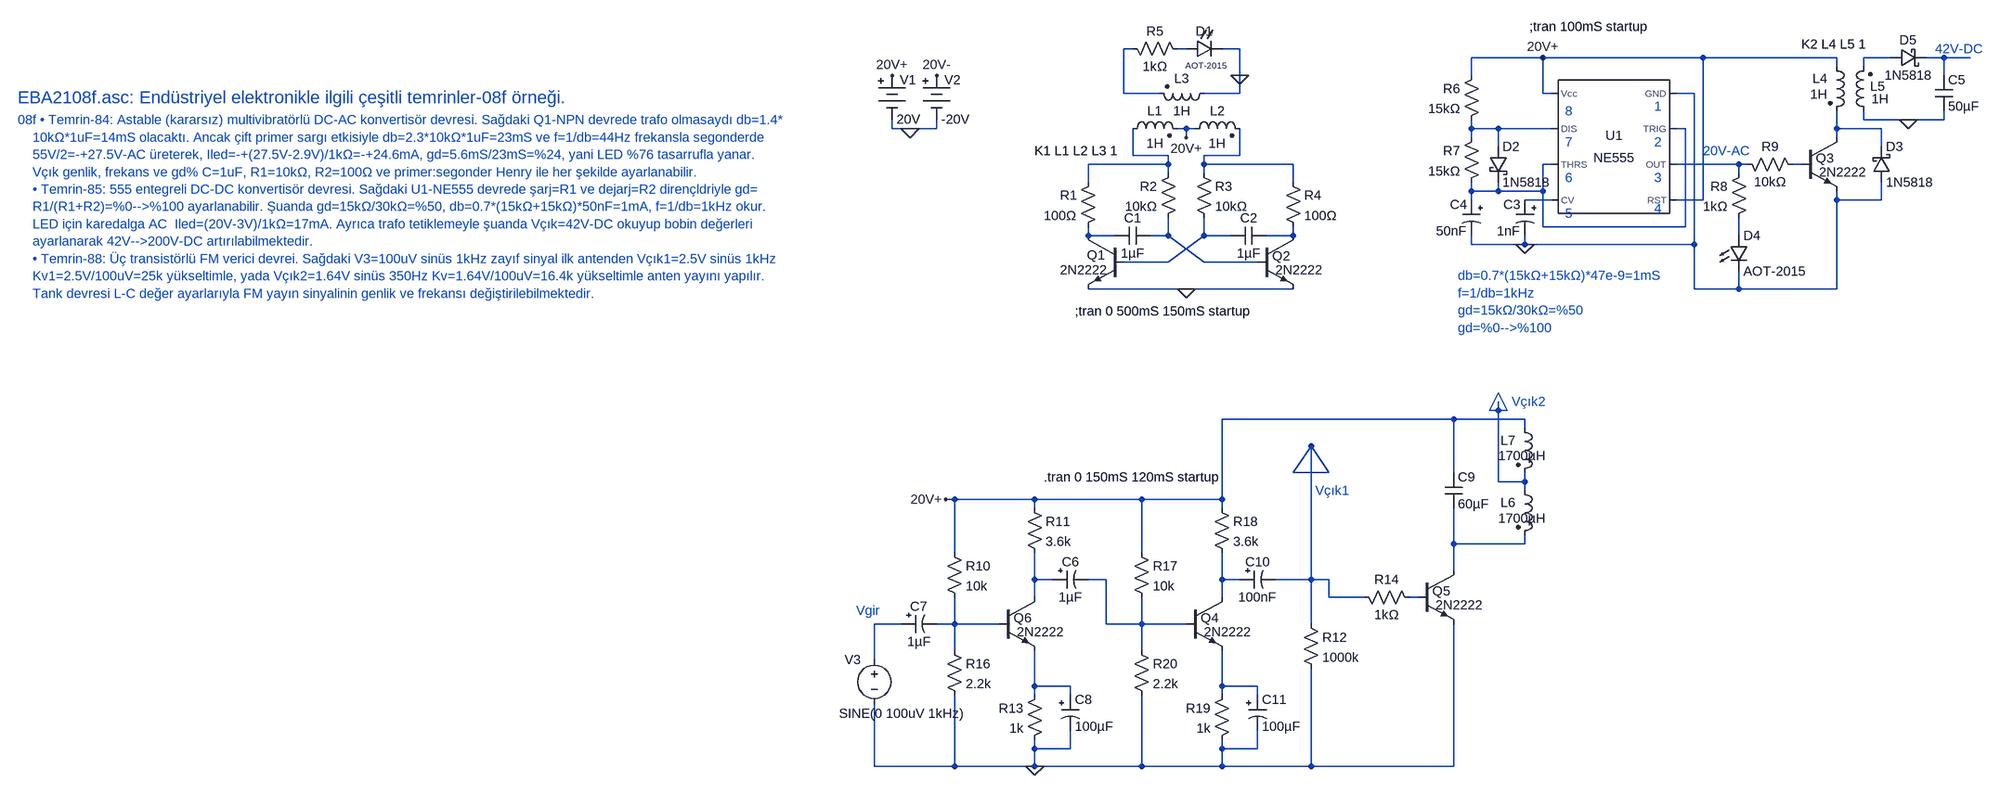
[diagram p0: schematic EBA2108f.asc]
EBA2108f.asc, the LTspice schematic file:
Version 4
SHEET 1 7064 4332
WIRE 2096 -32 2080 -32
WIRE 2192 -32 2176 -32
WIRE 2288 -32 2256 -32
WIRE 2832 -16 2704 -16
WIRE 3120 -16 2832 -16
WIRE 3360 -16 3120 -16
WIRE 3456 -16 3408 -16
WIRE 3552 -16 3520 -16
WIRE 3600 -16 3552 -16
WIRE 3360 0 3360 -16
WIRE 3408 0 3408 -16
WIRE 2288 16 2288 -32
WIRE 2704 16 2704 -16
WIRE 3552 16 3552 -16
WIRE 2080 48 2080 -32
WIRE 2144 48 2080 48
WIRE 2288 48 2288 16
WIRE 2288 48 2224 48
WIRE 2832 48 2832 -16
WIRE 2848 48 2832 48
WIRE 3104 48 3072 48
WIRE 3408 96 3408 80
WIRE 3488 96 3408 96
WIRE 3552 96 3552 80
WIRE 3552 96 3488 96
WIRE 1664 112 1664 96
WIRE 1696 112 1664 112
WIRE 1744 112 1744 96
WIRE 1744 112 1696 112
WIRE 2192 112 2176 112
WIRE 2208 112 2192 112
WIRE 2704 112 2704 96
WIRE 2752 112 2704 112
WIRE 2848 112 2752 112
WIRE 3088 112 3072 112
WIRE 3360 112 3360 80
WIRE 3440 112 3360 112
WIRE 2192 128 2192 112
WIRE 2704 128 2704 112
WIRE 3360 128 3360 112
WIRE 2752 144 2752 112
WIRE 3440 144 3440 112
WIRE 2096 160 2096 112
WIRE 2160 160 2096 160
WIRE 2288 160 2288 112
WIRE 2288 160 2224 160
WIRE 2160 176 2160 160
WIRE 2160 176 2016 176
WIRE 2224 176 2224 160
WIRE 2384 176 2224 176
WIRE 2848 176 2832 176
WIRE 3184 176 3072 176
WIRE 3200 176 3184 176
WIRE 3296 176 3280 176
WIRE 2160 192 2160 176
WIRE 2224 192 2224 176
WIRE 3184 192 3184 176
WIRE 2016 208 2016 176
WIRE 2384 208 2384 176
WIRE 2704 224 2704 208
WIRE 2752 224 2752 208
WIRE 2752 224 2704 224
WIRE 2832 224 2832 176
WIRE 2832 224 2752 224
WIRE 2704 240 2704 224
WIRE 2848 240 2800 240
WIRE 3120 240 3120 -16
WIRE 3120 240 3072 240
WIRE 3360 240 3360 224
WIRE 3440 240 3440 208
WIRE 3440 240 3360 240
WIRE 2832 288 2832 224
WIRE 3088 288 3088 112
WIRE 3088 288 2832 288
WIRE 2016 304 2016 288
WIRE 2064 304 2016 304
WIRE 2160 304 2160 272
WIRE 2160 304 2128 304
WIRE 2224 304 2224 272
WIRE 2272 304 2224 304
WIRE 2384 304 2384 288
WIRE 2384 304 2336 304
WIRE 3184 304 3184 272
WIRE 2704 320 2704 304
WIRE 2800 320 2800 304
WIRE 2800 320 2704 320
WIRE 3104 320 3104 48
WIRE 3104 320 2800 320
WIRE 2160 352 2224 304
WIRE 2160 352 2080 352
WIRE 2224 352 2160 304
WIRE 2320 352 2224 352
WIRE 2192 400 2016 400
WIRE 2384 400 2192 400
WIRE 3104 400 3104 320
WIRE 3184 400 3184 368
WIRE 3184 400 3104 400
WIRE 3360 400 3360 240
WIRE 3360 400 3184 400
WIRE 2736 640 2752 608
WIRE 2752 640 2752 624
WIRE 2752 640 2736 640
WIRE 2768 640 2752 608
WIRE 2768 640 2752 640
WIRE 2672 656 2256 656
WIRE 2800 656 2672 656
WIRE 2800 672 2800 656
WIRE 2384 752 2416 704
WIRE 2448 752 2416 704
WIRE 2448 752 2384 752
WIRE 2672 752 2672 656
WIRE 2752 768 2752 640
WIRE 2800 768 2800 752
WIRE 2800 768 2752 768
WIRE 2800 784 2800 768
WIRE 1776 800 1760 800
WIRE 1920 800 1776 800
WIRE 2112 800 1920 800
WIRE 2256 800 2256 656
WIRE 2256 800 2112 800
WIRE 1920 816 1920 800
WIRE 2256 816 2256 800
WIRE 2672 880 2672 816
WIRE 2800 880 2800 864
WIRE 2800 880 2672 880
WIRE 1776 896 1776 800
WIRE 2112 896 2112 800
WIRE 2672 928 2672 880
WIRE 1920 944 1920 896
WIRE 1952 944 1920 944
WIRE 2048 944 2016 944
WIRE 2256 944 2256 896
WIRE 2288 944 2256 944
WIRE 2416 944 2416 704
WIRE 2416 944 2352 944
WIRE 2448 944 2416 944
WIRE 1920 976 1920 944
WIRE 2256 976 2256 944
WIRE 2448 976 2448 944
WIRE 2512 976 2448 976
WIRE 2608 976 2592 976
WIRE 1680 1024 1632 1024
WIRE 1776 1024 1776 976
WIRE 1776 1024 1744 1024
WIRE 1856 1024 1776 1024
WIRE 2048 1024 2048 944
WIRE 2112 1024 2112 976
WIRE 2112 1024 2048 1024
WIRE 2192 1024 2112 1024
WIRE 2416 1024 2416 944
WIRE 1776 1072 1776 1024
WIRE 2112 1072 2112 1024
WIRE 1632 1088 1632 1024
WIRE 1920 1136 1920 1072
WIRE 1984 1136 1920 1136
WIRE 2256 1136 2256 1072
WIRE 2320 1136 2256 1136
WIRE 1920 1152 1920 1136
WIRE 1984 1152 1984 1136
WIRE 2256 1152 2256 1136
WIRE 2320 1152 2320 1136
WIRE 1920 1248 1920 1232
WIRE 1984 1248 1984 1216
WIRE 1984 1248 1920 1248
WIRE 2256 1248 2256 1232
WIRE 2320 1248 2320 1216
WIRE 2320 1248 2256 1248
WIRE 1632 1280 1632 1168
WIRE 1776 1280 1776 1152
WIRE 1776 1280 1632 1280
WIRE 1920 1280 1920 1248
WIRE 1920 1280 1776 1280
WIRE 2112 1280 2112 1152
WIRE 2112 1280 1920 1280
WIRE 2256 1280 2256 1248
WIRE 2256 1280 2112 1280
WIRE 2416 1280 2416 1104
WIRE 2416 1280 2256 1280
WIRE 2672 1280 2672 1024
WIRE 2672 1280 2416 1280
FLAG 1696 112 0
FLAG 1664 16 20V+
FLAG 1744 16 20V-
FLAG 2192 400 0
FLAG 2192 128 20V+
FLAG 2288 16 0
FLAG 2800 320 0
FLAG 2832 -16 20V+
FLAG 3488 96 0
FLAG 1760 800 20V+
FLAG 1920 1280 0
SYMBOL Misc\\battery 1664 0 R0
WINDOW 3 8 95 Left 2
WINDOW 0 14 24 Left 2
SYMATTR Value 20V
SYMATTR InstName V1
SYMBOL Misc\\battery 1744 0 R0
WINDOW 3 8 95 Left 2
WINDOW 0 14 24 Left 2
SYMATTR Value -20V
SYMATTR InstName V2
SYMBOL npn 2080 304 M0
WINDOW 0 34 35 Left 2
WINDOW 3 30 62 Left 2
SYMATTR InstName Q1
SYMATTR Value 2N2222
SYMBOL res 2032 192 M0
SYMATTR InstName R1
SYMATTR Value 100Ω
SYMBOL cap 2128 288 R90
WINDOW 0 0 32 VBottom 2
WINDOW 3 32 32 VTop 2
SYMATTR InstName C1
SYMATTR Value 1µF
SYMBOL res 2176 176 M0
SYMATTR InstName R2
SYMATTR Value 10kΩ
SYMBOL npn 2320 304 R0
WINDOW 0 26 37 Left 2
WINDOW 3 32 62 Left 2
SYMATTR InstName Q2
SYMATTR Value 2N2222
SYMBOL cap 2272 288 M90
WINDOW 0 0 32 VBottom 2
WINDOW 3 32 32 VTop 2
SYMATTR InstName C2
SYMATTR Value 1µF
SYMBOL res 2208 176 R0
SYMATTR InstName R3
SYMATTR Value 10kΩ
SYMBOL res 2368 192 R0
SYMATTR InstName R4
SYMATTR Value 100Ω
SYMBOL ind2 2080 128 R270
WINDOW 0 32 56 VTop 2
WINDOW 3 5 56 VBottom 2
SYMATTR InstName L1
SYMATTR Value 1H
SYMATTR Type ind
SYMBOL ind2 2192 128 R270
WINDOW 0 32 56 VTop 2
WINDOW 3 5 56 VBottom 2
SYMATTR InstName L2
SYMATTR Value 1H
SYMATTR Type ind
SYMBOL ind2 2240 32 R90
WINDOW 0 5 56 VBottom 2
WINDOW 3 32 56 VTop 2
SYMATTR InstName L3
SYMATTR Value 1H
SYMATTR Type ind
SYMBOL LED 2192 -48 M90
WINDOW 0 0 32 VBottom 2
WINDOW 3 36 36 VTop 1
SYMATTR InstName D1
SYMATTR Value AOT-2015
SYMATTR Description Diode
SYMATTR Type diode
SYMBOL res 2080 -48 M90
WINDOW 0 0 56 VBottom 2
WINDOW 3 32 56 VTop 2
SYMATTR InstName R5
SYMATTR Value 1kΩ
SYMBOL Misc\\NE555 2960 144 M0
SYMATTR InstName U1
SYMBOL polcap 2816 240 M0
SYMATTR InstName C3
SYMATTR Value 1nF
SYMBOL polcap 2720 240 M0
SYMATTR InstName C4
SYMATTR Value 50nF
SYMBOL res 2720 0 M0
SYMATTR InstName R6
SYMATTR Value 15kΩ
SYMBOL res 2720 112 M0
SYMATTR InstName R7
SYMATTR Value 15kΩ
SYMBOL schottky 2736 144 R0
SYMATTR InstName D2
SYMATTR Value 1N5818
SYMATTR Description Diode
SYMATTR Type diode
SYMBOL res 3200 176 M0
SYMATTR InstName R8
SYMATTR Value 1kΩ
SYMBOL npn 3296 128 R0
WINDOW 0 26 37 Left 2
WINDOW 3 32 62 Left 2
SYMATTR InstName Q3
SYMATTR Value 2N2222
SYMBOL schottky 3424 208 M180
WINDOW 0 24 64 Left 2
WINDOW 3 24 0 Left 2
SYMATTR InstName D3
SYMATTR Value 1N5818
SYMATTR Description Diode
SYMATTR Type diode
SYMBOL ind2 3344 -16 R0
WINDOW 0 -28 38 Left 2
WINDOW 3 -32 66 Left 2
SYMATTR InstName L4
SYMATTR Value 1H
SYMATTR Type ind
SYMBOL ind2 3424 96 R180
WINDOW 0 -23 60 Left 2
WINDOW 3 -29 38 Left 2
SYMATTR InstName L5
SYMATTR Value 1H
SYMATTR Type ind
SYMBOL LED 3168 304 R0
SYMATTR InstName D4
SYMATTR Value AOT-2015
SYMATTR Description Diode
SYMATTR Type diode
SYMBOL schottky 3456 -32 M90
WINDOW 0 0 32 VBottom 2
WINDOW 3 32 32 VTop 2
SYMATTR InstName D5
SYMATTR Value 1N5818
SYMATTR Description Diode
SYMATTR Type diode
SYMBOL cap 3536 16 R0
SYMATTR InstName C5
SYMATTR Value 50µF
SYMBOL res 3296 192 M270
WINDOW 0 32 56 VTop 2
WINDOW 3 0 56 VBottom 2
SYMATTR InstName R9
SYMATTR Value 10kΩ
SYMBOL res 2608 992 M270
WINDOW 0 32 56 VTop 2
WINDOW 3 0 56 VBottom 2
SYMATTR InstName R14
SYMATTR Value 1kΩ
SYMBOL npn 2608 928 R0
WINDOW 0 26 37 Left 2
WINDOW 3 32 62 Left 2
SYMATTR InstName Q5
SYMATTR Value 2N2222
SYMBOL cap 2656 752 R0
SYMATTR InstName C9
SYMATTR Value 60µF
SYMBOL ind2 2784 768 R0
WINDOW 0 -28 38 Left 2
WINDOW 3 -32 66 Left 2
SYMATTR InstName L6
SYMATTR Value 1700µH
SYMATTR Type ind
SYMBOL ind2 2784 656 R0
WINDOW 0 -28 38 Left 2
WINDOW 3 -32 66 Left 2
SYMATTR InstName L7
SYMATTR Value 1700µH
SYMATTR Type ind
SYMBOL res 1760 880 R0
SYMATTR InstName R10
SYMATTR Value 10k
SYMBOL res 1904 800 R0
SYMATTR InstName R11
SYMATTR Value 3.6k
SYMBOL polcap 1952 928 M90
WINDOW 0 0 32 VBottom 2
WINDOW 3 32 32 VTop 2
SYMATTR InstName C6
SYMATTR Value 1µF
SYMBOL polcap 1680 1008 M90
WINDOW 0 0 32 VBottom 2
WINDOW 3 32 32 VTop 2
SYMATTR InstName C7
SYMATTR Value 1µF
SYMBOL voltage 1632 1072 M0
WINDOW 3 -160 113 Left 2
WINDOW 123 0 0 Left 0
WINDOW 39 0 0 Left 0
SYMATTR Value SINE(0 100uV 1kHz)
SYMATTR InstName V3
SYMBOL res 2400 1008 R0
SYMATTR InstName R12
SYMATTR Value 1000k
SYMBOL res 1936 1136 M0
SYMATTR InstName R13
SYMATTR Value 1k
SYMBOL res 1760 1056 R0
SYMATTR InstName R16
SYMATTR Value 2.2k
SYMBOL polcap 1968 1152 R0
SYMATTR InstName C8
SYMATTR Value 100µF
SYMBOL res 2096 880 R0
SYMATTR InstName R17
SYMATTR Value 10k
SYMBOL res 2240 800 R0
SYMATTR InstName R18
SYMATTR Value 3.6k
SYMBOL polcap 2288 928 M90
WINDOW 0 0 32 VBottom 2
WINDOW 3 32 32 VTop 2
SYMATTR InstName C10
SYMATTR Value 100nF
SYMBOL res 2272 1136 M0
SYMATTR InstName R19
SYMATTR Value 1k
SYMBOL res 2096 1056 R0
SYMATTR InstName R20
SYMATTR Value 2.2k
SYMBOL polcap 2304 1152 R0
SYMATTR InstName C11
SYMATTR Value 100µF
SYMBOL npn 2192 976 R0
WINDOW 0 26 37 Left 2
WINDOW 3 32 62 Left 2
SYMATTR InstName Q4
SYMATTR Value 2N2222
SYMBOL npn 1856 976 R0
WINDOW 0 26 37 Left 2
WINDOW 3 32 62 Left 2
SYMATTR InstName Q6
SYMATTR Value 2N2222
TEXT -232 56 Left 3 ;EBA2108f.asc: Endüstriyel elektronikle ilgili çeşitli temrinler-08f örneği.
TEXT -232 96 Left 2 ;08f • Temrin-84: Astable (kararsız) multivibratörlü DC-AC konvertisör devresi. Sağdaki Q1-NPN devrede trafo olmasaydı db=1.4*\n    10kΩ*1uF=14mS olacaktı. Ancak çift primer sargı etkisiyle db=2.3*10kΩ*1uF=23mS ve f=1/db=44Hz frekansla segonderde \n    55V/2=-+27.5V-AC üreterek, Iled=-+(27.5V-2.9V)/1kΩ=-+24.6mA, gd=5.6mS/23mS=%24, yani LED %76 tasarrufla yanar. \n    Vçık genlik, frekans ve gd% C=1uF, R1=10kΩ, R2=100Ω ve primer:segonder Henry ile her şekilde ayarlanabilir.\n    • Temrin-85: 555 entegreli DC-DC konvertisör devresi. Sağdaki U1-NE555 devrede şarj=R1 ve dejarj=R2 dirençldriyle gd=\n    R1/(R1+R2)=%0-->%100 ayarlanabilir. Şuanda gd=15kΩ/30kΩ=%50, db=0.7*(15kΩ+15kΩ)*50nF=1mA, f=1/db=1kHz okur.\n    LED için karedalga AC  Iled=(20V-3V)/1kΩ=17mA. Ayrıca trafo tetiklemeyle şuanda Vçık=42V-DC okuyup bobin değerleri\n    ayarlanarak 42V-->200V-DC artırılabilmektedir.\n    • Temrin-88: Üç transistörlü FM verici devrei. Sağdaki V3=100uV sinüs 1kHz zayıf sinyal ilk antenden Vçık1=2.5V sinüs 1kHz\n    Kv1=2.5V/100uV=25k yükseltimle, yada Vçık2=1.64V sinüs 350Hz Kv=1.64V/100uV=16.4k yükseltimle anten yayını yapılır.\n    Tank devresi L-C değer ayarlarıyla FM yayın sinyalinin genlik ve frekansı değiştirilebilmektedir.
TEXT 1992 440 Left 2 !;tran 0 500mS 150mS startup
TEXT 1920 152 Left 2 !K1 L1 L2 L3 1
TEXT 3032 72 Left 2 ;1
TEXT 3032 136 Left 2 ;2
TEXT 3032 200 Left 2 ;3
TEXT 2872 200 Left 2 ;6
TEXT 2872 136 Left 2 ;7
TEXT 2872 80 Left 2 ;8
TEXT 3032 256 Left 2 ;4
TEXT 2872 264 Left 2 ;5
TEXT 2808 -72 Left 2 !;tran 100mS startup
TEXT 3296 -40 Left 2 !K2 L4 L5 1
TEXT 2680 376 Left 2 ;db=0.7*(15kΩ+15kΩ)*47e-9=1mS\nf=1/db=1kHz\ngd=15kΩ/30kΩ=%50\ngd=%0-->%100
TEXT 3120 152 Left 2 ;20V-AC
TEXT 3536 -32 Left 2 ;42V-DC
TEXT 2424 784 Left 2 ;Vçık1
TEXT 1600 1000 Left 2 ;Vgir
TEXT 1936 760 Left 2 !.tran 0 150mS 120mS startup
TEXT 2776 624 Left 2 ;Vçık2

The netlist it stands for:
* EBA2108f.asc
V1 20V+ 0 20V
V2 20V- 0 -20V
Q1 N013 N015 0 0 2N2222
R1 N008 N013 100Ω
C1 N014 N013 1µF
R2 N008 N014 10kΩ
Q2 N016 N014 0 0 2N2222
C2 N015 N016 1µF
R3 N009 N015 10kΩ
R4 N009 N016 100Ω
L1 N008 20V+ 1H
L2 20V+ N009 1H
L3 0 N001 1H
D1 N002 0 AOT-2015
R5 N001 N002 1kΩ
XU1 0 N006 N010 20V+ N012 N006 N005 20V+ NE555  ; pins GND TRIG OUT RST CV THRS DIS Vcc
C3 N012 0 1nF
C4 N006 0 50nF
R6 20V+ N005 15kΩ
R7 N005 N006 15kΩ
D2 N005 N006 1N5818
R8 N010 N017 1kΩ
Q3 N007 N011 0 0 2N2222
D3 0 N007 1N5818
L4 20V+ N007 1H
L5 0 N003 1H
D4 N017 0 AOT-2015
D5 N003 N004 1N5818
C5 N004 0 50µF
R9 N011 N010 10kΩ
R14 N024 N019 1kΩ
Q5 N020 N024 0 0 2N2222
C9 20V+ N020 60µF
L6 N018 N020 1700µH
L7 20V+ N018 1700µH
R10 20V+ N026 10k
R11 20V+ N021 3.6k
C6 N021 N022 1µF
C7 N025 N026 1µF
V3 N025 0 SINE(0 100uV 1kHz)
R12 N019 0 1000k
R13 N027 0 1k
R16 N026 0 2.2k
C8 N027 0 100µF
R17 20V+ N022 10k
R18 20V+ N023 3.6k
C10 N023 N019 100nF
R19 N028 0 1k
R20 N022 0 2.2k
C11 N028 0 100µF
Q4 N023 N022 N028 0 2N2222
Q6 N021 N026 N027 0 2N2222
.model D D
.lib standard.dio
.model NPN NPN
.model PNP PNP
.lib standard.bjt
* EBA2108f.asc: Endüstriyel elektronikle ilgili çeşitli temrinler-08f örneği.
* 08f • Temrin-84: Astable (kararsız) multivibratörlü DC-AC konvertisör devresi. Sağdaki Q1-NPN devrede trafo olmasaydı db=1.4*
*     10kΩ*1uF=14mS olacaktı. Ancak çift primer sargı etkisiyle db=2.3*10kΩ*1uF=23mS ve f=1/db=44Hz frekansla segonderde
*     55V/2=-+27.5V-AC üreterek, Iled=-+(27.5V-2.9V)/1kΩ=-+24.6mA, gd=5.6mS/23mS=%24, yani LED %76 tasarrufla yanar.
*     Vçık genlik, frekans ve gd% C=1uF, R1=10kΩ, R2=100Ω ve primer:segonder Henry ile her şekilde ayarlanabilir.
*     • Temrin-85: 555 entegreli DC-DC konvertisör devresi. Sağdaki U1-NE555 devrede şarj=R1 ve dejarj=R2 dirençldriyle gd=
*     R1/(R1+R2)=%0-->%100 ayarlanabilir. Şuanda gd=15kΩ/30kΩ=%50, db=0.7*(15kΩ+15kΩ)*50nF=1mA, f=1/db=1kHz okur.
*     LED için karedalga AC  Iled=(20V-3V)/1kΩ=17mA. Ayrıca trafo tetiklemeyle şuanda Vçık=42V-DC okuyup bobin değerleri
*     ayarlanarak 42V-->200V-DC artırılabilmektedir.
*     • Temrin-88: Üç transistörlü FM verici devrei. Sağdaki V3=100uV sinüs 1kHz zayıf sinyal ilk antenden Vçık1=2.5V sinüs 1kHz
*     Kv1=2.5V/100uV=25k yükseltimle, yada Vçık2=1.64V sinüs 350Hz Kv=1.64V/100uV=16.4k yükseltimle anten yayını yapılır.
*     Tank devresi L-C değer ayarlarıyla FM yayın sinyalinin genlik ve frekansı değiştirilebilmektedir.
;tran 0 500mS 150mS startup
K1 L1 L2 L3 1
* 1
* 2
* 3
* 6
* 7
* 8
* 4
* 5
;tran 100mS startup
K2 L4 L5 1
* db=0.7*(15kΩ+15kΩ)*47e-9=1mS
* f=1/db=1kHz
* gd=15kΩ/30kΩ=%50
* gd=%0-->%100
* 20V-AC
* 42V-DC
* Vçık1
* Vgir
.tran 0 150mS 120mS startup
* Vçık2
.lib NE555.sub
.backanno
.end